# Altium schematic sheet MultimediaEthernet_LED.SchDoc
size Letter
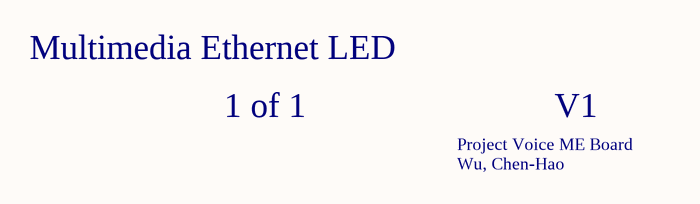
[diagram p0: MultimediaEthernet_LED.SchDoc]

## Notes on the sheet
- Multimedia Ethernet LED
- 1 of 1
- Project Voice ME Board
- V1
- Wu, Chen-Hao